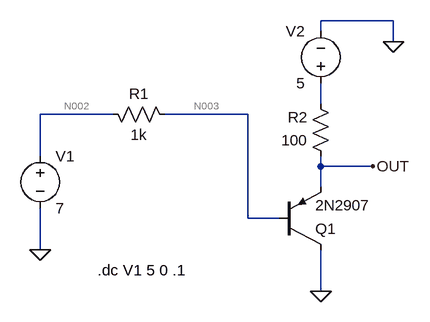
[diagram p0: schematic pnp.asc]
pnp.asc, the LTspice schematic file:
Version 4.1
SHEET 1 880 680
WIRE 640 -96 528 -96
WIRE 528 -80 528 -96
WIRE 640 -64 640 -96
WIRE 528 32 528 0
WIRE 208 48 96 48
WIRE 416 48 288 48
WIRE 96 112 96 48
WIRE 528 128 528 112
WIRE 608 128 528 128
WIRE 528 160 528 128
WIRE 416 208 416 48
WIRE 464 208 416 208
WIRE 96 256 96 192
WIRE 528 320 528 256
FLAG 96 256 0
FLAG 528 320 0
FLAG 640 -64 0
FLAG 608 128 OUT
SYMBOL voltage 96 96 R0
WINDOW 123 0 0 Left 0
WINDOW 39 0 0 Left 0
SYMATTR InstName V1
SYMATTR Value 7
SYMBOL res 192 32 M90
WINDOW 0 0 56 VBottom 2
WINDOW 3 32 56 VTop 2
SYMATTR InstName R1
SYMATTR Value 1k
SYMBOL voltage 528 16 R180
WINDOW 0 24 96 Left 2
WINDOW 3 24 16 Left 2
WINDOW 123 0 0 Left 0
WINDOW 39 0 0 Left 0
SYMATTR InstName V2
SYMATTR Value 5
SYMBOL res 544 128 R180
WINDOW 0 36 76 Left 2
WINDOW 3 36 40 Left 2
SYMATTR InstName R2
SYMATTR Value 100
SYMBOL pnp 464 256 M180
SYMATTR InstName Q1
SYMATTR Value 2N2907
TEXT 184 288 Left 2 !.dc V1 5 0 .1

The netlist it stands for:
* pnp.asc
V1 N002 0 7
R1 N002 N003 1k
V2 N001 0 5
R2 OUT N001 100
Q1 0 N003 OUT 0 2N2907
.model NPN NPN
.model PNP PNP
.lib standard.bjt
.dc V1 5 0 .1
.backanno
.end

* Results of the author's LTspice run, read from the files saved beside the schematic
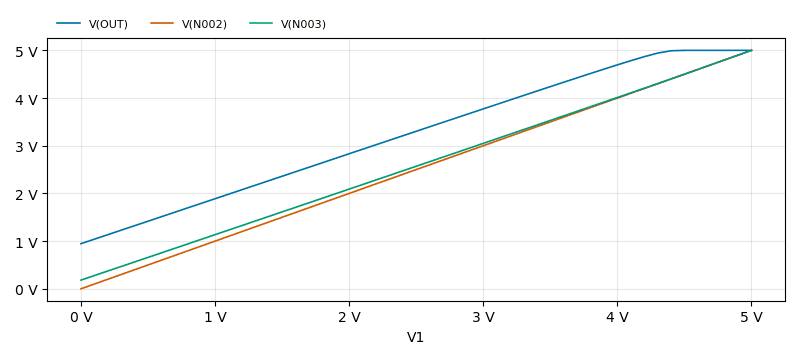
[diagram p1: DC transfer characteristic of pnp.asc, plotted from the saved traces]
* DC transfer characteristic, 1 run:
*   V(OUT): 5 V at V1=5 V, 946.7 mV at V1=0 V, min 946.7 mV, max 5 V
*   V(N002): 5 V at V1=5 V, 0 V at V1=0 V, min 0 V, max 5 V
*   V(N003): 5 V at V1=5 V, 182.8 mV at V1=0 V, min 182.8 mV, max 5 V